# Altium project GPS_LEA5S.v.0.1.PrjPCB
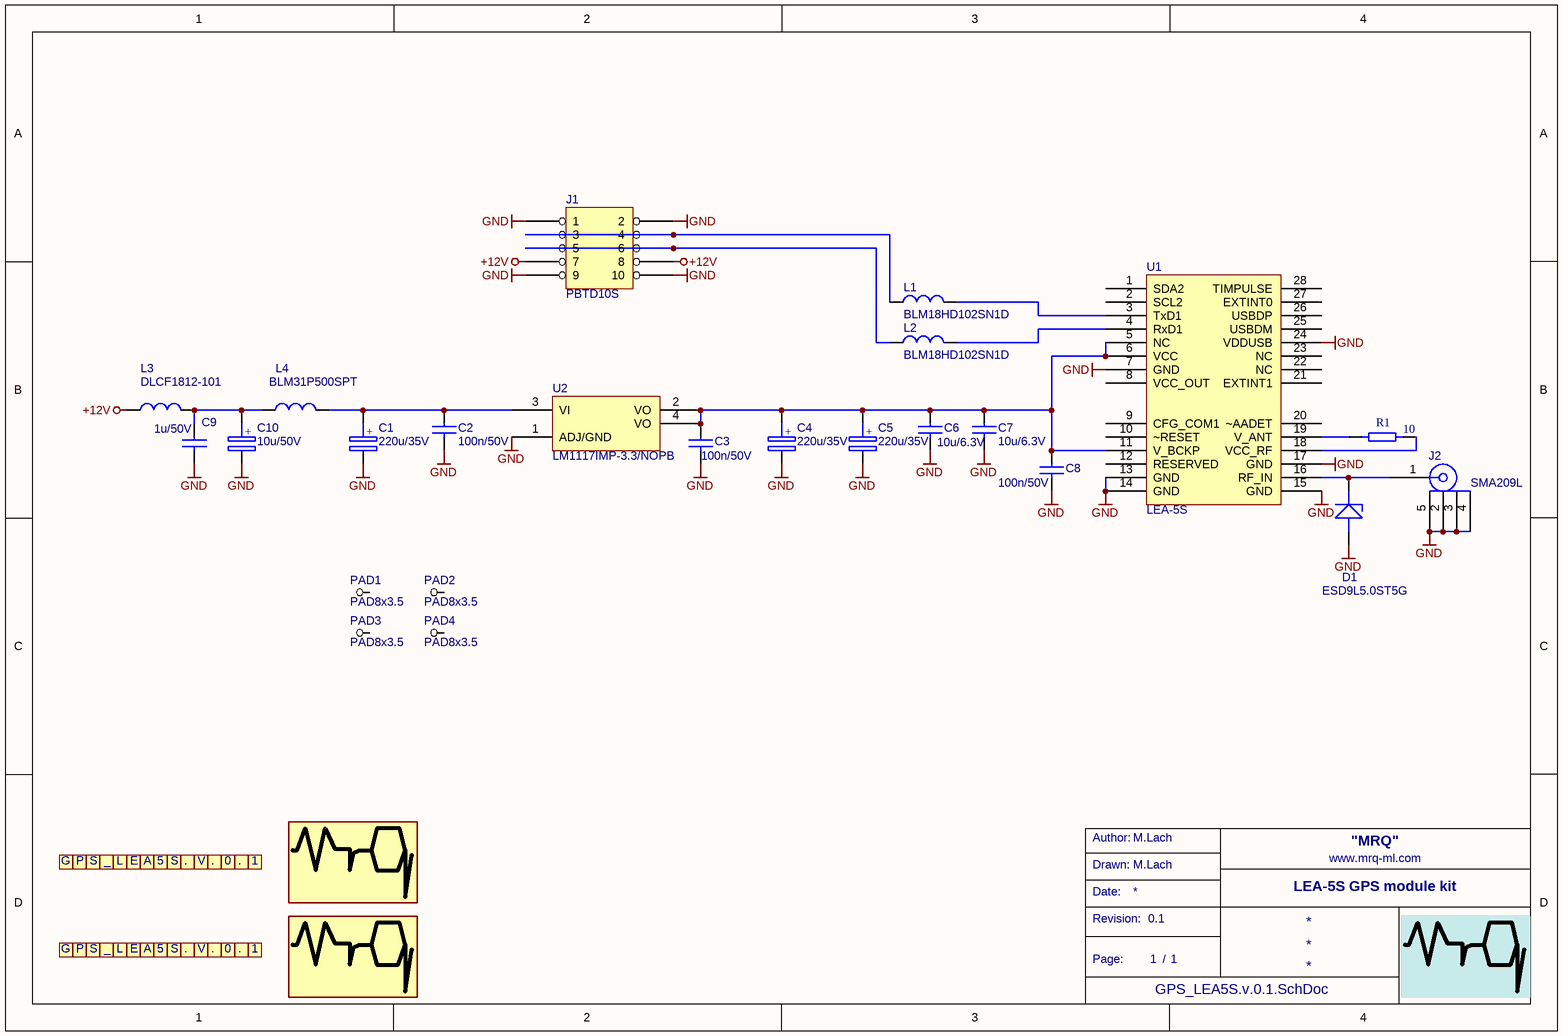
[diagram p0: GPS_LEA5S.v.0.1.SchDoc]
1 sheet, 57 parts. Net scope: global (net labels, ports and power ports of the same name join across sheets).
Board file: GPS_LEA5S.v.0.1.PcbDoc

## Sheet GPS_LEA5S.v.0.1.SchDoc: LEA-5S GPS module kit
size A4; Author: M.Lach; DrawnBy: M.Lach; Organization: "MRQ"; Address1: www.mrq-ml.com; DocumentNumber: 1; Revision: 0.1; SheetNumber: 1; SheetTotal: 1; LotOfPieces: 5

### Parts
C1  220u/35V  [CELE]
C2  100n/50V  [0805]
C3  100n/50V  [0805]
C4  220u/35V  [CELE]
C5  220u/35V  [CELE]
C6  10u/6.3V  [1206]
C7  10u/6.3V  [1206]
C8  100n/50V  [0805]
C9  1u/50V  [1206]
C10  10u/50V  [CE6.3x5.5]
D1  ESD9L5.0ST5G  [SOD923]
J1  PBTD10S  [PBTD10S]
J2  SMA209L  [SMA209L]
L1  BLM18HD102SN1D  [0603]
L2  BLM18HD102SN1D  [0603]
L3  DLCF1812-101  [1812]
L4  BLM31P500SPT  [1206]
LETTER1  LETTER_E  [LETTERC_E_60_10_TS]  (value not drawn)  (no BOM)
LETTER2  LETTER_DOT  [LETTER_DOT_60_10_TS]  (value not drawn)  (no BOM)
LETTER3  LETTER_G  [LETTERC_G_60_10_TS]  (value not drawn)  (no BOM)
LETTER4  LETTER_DOT  [LETTER_DOT_60_10_TS]  (value not drawn)  (no BOM)
LETTER5  LETTER_S  [LETTERC_S_60_10_TS]  (value not drawn)  (no BOM)
LETTER6  LETTER_P  [LETTERC_P_60_10_TS]  (value not drawn)  (no BOM)
LETTER7  LETTER_P  [LETTERC_L_60_10_TS]  (value not drawn)  (no BOM)
LETTER8  LETTER_DOT  [LETTER_DOT_60_10_TS]  (value not drawn)  (no BOM)
LETTER9  LETTER_1  [LETTER_1_60_10_TS]  (value not drawn)  (no BOM)
LETTER10  LETTER_G  [LETTERC_G_60_10_TS]  (value not drawn)  (no BOM)
LETTER11  LETTER_UNDERSCORE  [LETTER_UNDERSCORE_60_10_TS]  (value not drawn)  (no BOM)
LETTER12  LETTER_A_CAPITAL  [LETTERC_A_60_10_TS]  (value not drawn)  (no BOM)
LETTER13  LETTER_5  [LETTER_5_60_10_TS]  (value not drawn)  (no BOM)
LETTER14  LETTER_S  [LETTERC_S_60_10_TS]  (value not drawn)  (no BOM)
LETTER15  LETTER_P  [LETTERC_P_60_10_TS]  (value not drawn)  (no BOM)
LETTER16  LETTER_V  [LETTER_V_60_10_TS]  (value not drawn)  (no BOM)
LETTER17  LETTER_S  [LETTERC_S_60_10_TS]  (value not drawn)  (no BOM)
LETTER18  LETTER_0  [LETTER_0_60_10_TS]  (value not drawn)  (no BOM)
LETTER19  LETTER_UNDERSCORE  [LETTER_UNDERSCORE_60_10_TS]  (value not drawn)  (no BOM)
LETTER20  LETTER_P  [LETTERC_L_60_10_TS]  (value not drawn)  (no BOM)
LETTER21  LETTER_E  [LETTERC_E_60_10_TS]  (value not drawn)  (no BOM)
LETTER22  LETTER_A_CAPITAL  [LETTERC_A_60_10_TS]  (value not drawn)  (no BOM)
LETTER23  LETTER_5  [LETTER_5_60_10_TS]  (value not drawn)  (no BOM)
LETTER24  LETTER_S  [LETTERC_S_60_10_TS]  (value not drawn)  (no BOM)
LETTER25  LETTER_DOT  [LETTER_DOT_60_10_TS]  (value not drawn)  (no BOM)
LETTER26  LETTER_V  [LETTER_V_60_10_TS]  (value not drawn)  (no BOM)
LETTER27  LETTER_DOT  [LETTER_DOT_60_10_TS]  (value not drawn)  (no BOM)
LETTER28  LETTER_0  [LETTER_0_60_10_TS]  (value not drawn)  (no BOM)
LETTER29  LETTER_DOT  [LETTER_DOT_60_10_TS]  (value not drawn)  (no BOM)
LETTER30  LETTER_1  [LETTER_1_60_10_TS]  (value not drawn)  (no BOM)
LOGO1  MRQLOGO  [MRQ_5_TS]  (value not drawn)  (no BOM)
LOGO3  MRQLOGO  [MRQ_5_TS]  (value not drawn)  (no BOM)
PAD1  PAD8x3.5  [PAD8x3.5]  (no BOM)
PAD2  PAD8x3.5  [PAD8x3.5]  (no BOM)
PAD3  PAD8x3.5  [PAD8x3.5]  (no BOM)
PAD4  PAD8x3.5  [PAD8x3.5]  (no BOM)
R1  10  [0805]
TB  TITLEBLOCK  (value not drawn)  (graphical)
U1  LEA-5S  [LEA-LA]
U2  LM1117IMP-3.3/NOPB  [SOT-223]

### Nets
+12V: J1.7 J1.8 L3.1
GND: C1.1 C2.2 C3.2 C4.1 C5.1 C6.2 C7.2 C8.2 C9.2 C10.1 D1.ANOD J1.1 J1.2 J1.9 J1.10 J2.2 J2.3 J2.4 J2.5 U1.7(GND) U1.13(GND) U1.14(GND) U1.15(GND) U1.17(GND) U1.24(VDDUSB) U2.1(ADJ/GND)
NetC1_2: C1.2 C2.1 L4.2 U2.3(VI)
NetC3_1: C3.1 C4.2 C5.2 C6.1 C7.1 C8.1 U1.5(NC) U1.6(VCC) U1.11(V_BCKP) U2.2(VO) U2.4(VO)
NetC9_1: C9.1 C10.2 L3.2 L4.1
NetD1_CATH: D1.CATH J2.1 U1.16(RF_IN)
NetJ1_3: J1.3 J1.4 L1.1
NetJ1_5: J1.5 J1.6 L2.1
NetL1_2: L1.2 U1.3(TxD1)
NetL2_2: L2.2 U1.4(RxD1)
NetR1_1: R1.1 U1.19(V_ANT)
NetR1_2: R1.2 U1.18(VCC_RF)

Not connected (* = marked no-connect by the designer): PAD1 1; PAD2 1; PAD3 1; PAD4 1; U1 1(SDA2) 2(SCL2) 8(VCC_OUT) 9(CFG_COM1) 10(~RESET) 12(RESERVED) 20(~AADET) 21(EXTINT1) 22(NC) 23(NC) 25(USBDM) 26(USBDP) 27(EXTINT0) 28(TIMPULSE)

### Notes on the sheet
- (in symbol 10u/50V[[/\]]CE6.3x5.5[[/\]]50V[[/\]]20%[[/\]]CE10/50-SMD) +
- (in symbol 220u/35V[[/\]]CELE[[/\]]35V[[/\]]20%[[/\]]VRF227M1VFT2TRS1) +
- (in symbol LETTER_0) 0
- (in symbol LETTER_1) 1
- (in symbol LETTER_5) 5
- (in symbol LETTER_A) A
- (in symbol LETTER_DOT) .
- (in symbol LETTER_E) E
- (in symbol LETTER_G) G
- (in symbol LETTER_L) L
- (in symbol LETTER_P) P
- (in symbol LETTER_S) S
- (in symbol LETTER_UNDERSCORE) _
- (in symbol LETTER_V) V
- (in symbol TITLEBLOCK) Author:; Drawn:; Date:; Revision:; Page:; /

### Library data of the parts
C1 C4 C5 = 220u/35V[[/\]]CELE[[/\]]35V[[/\]]20%[[/\]]VRF227M1VFT2TRS1: Manufacturer1: Samxon; Reference1: VRF220/35; MaxVoltage: 35V; Tolerance: 20%; Tmin: -55; Tmax: +105; Descript: capacitor 220uF, 6.3V, CELE (8x10.2); DeliveryTime1: up to 14 days; Currency1: PLZ; Amount1: 1000+; Amount5: 10+; Amount3: 250+; Amount4: 50+; Value: 220u/35V; Price1: 0,65; Supplier1: tme.pl; Typ1: VRF227M1VFT2TRS1; Dimensions: CELE; OtherParams: VRF227M1VFT2TRS1; ComponentLink1Description: Datasheet; ComponentLink1URL: http://www.mrq-ml.com/Parts/Capacitors/vrf.pdf; Supplier5: tme.pl; Reference5: VRF220/35; Manufacturer5: Samxon; Typ5: VRF227M1VFT2TRS1; DeliveryTime5: up to 14 days; Price5: 0,99; Currency5: PLZ; Currency3: PLZ; Currency4: PLZ; DateOfPrice1: 2009-10-06; DateOfPrice3: 2009-10-06; DateOfPrice4: 2009-10-06; DateOfPrice5: 2009-10-06; DeliveryTime3: up to 14 days; DeliveryTime4: up to 14 days; Manufacturer3: Samxon; Manufacturer4: Samxon; Price3: 0,73; Price4: 0,49; Reference3: VRF220/35; Reference4: VRF220/35; Supplier3: tme.pl; Supplier4: tme.pl; Typ3: VRF227M1VFT2TRS1; Typ4: VRF227M1VFT2TRS1
C2 C3 C8 = 100n/50V[[/\]]0805[[/\]]50V[[/\]]10%[[/\]]CL21B104KBCNNNC: Manufacturer1: Samsung; MaxVoltage: 50V; Tolerance: 10%; Tmin: -55; Tmax: +125; Descript: capacitor 100nF/50V, 0805, X7R, 10%; Currency1: PLZ; Amount1: 12000+; Amount5: 100+; Amount2: 4000+; Amount3: 1000+; Amount4: 300+; DeliveryTime1: up to 14 days; Supplier1: tme.pl; Price1: 0,011; Value: 100n/50V; Supplier2: tme.pl; Supplier3: tme.pl; Price2: 0,013; Price3: 0,017; Reference1: CL21B104KBCNNNC; Reference2: CL21B104KBCNNNC; Reference3: CL21B104KBCNNNC; Typ1: CL21B104KBCNNNC; Dimensions: 0805; OtherParams: CL21B104KBCNNNC; Supplier5: tme.pl; Reference5: CL21B104KBCNNNC; Manufacturer5: Samsung; Typ5: CL21B104KBCNNNC; Price5: 0,031; Currency5: PLZ; ComponentLink1Description: Datasheet; ComponentLink1URL: http://www.mrq-ml.com/Parts/Capacitors/mlcc_samsung.pdf; Currency2: PLZ; Currency3: PLZ; Currency4: PLZ; DateOfPrice1: 2009-07-22; DateOfPrice2: 2009-07-22; DateOfPrice3: 2009-07-22; DateOfPrice4: 2009-07-22; DateOfPrice5: 2009-07-22; DeliveryTime2: up to 14 days; DeliveryTime3: up to 14 days; DeliveryTime4: up to 14 days; DeliveryTime5: up to 14 days; Manufacturer2: Samsung; Manufacturer3: Samsung; Manufacturer4: Samsung; Price4: 0,024; Reference4: CL21B104KBCNNNC; Supplier4: tme.pl; Typ2: CL21B104KBCNNNC; Typ3: CL21B104KBCNNNC; Typ4: CL21B104KBCNNNC
C6 C7 = 10u/6.3V[[/\]]1206[[/\]]6.3V[[/\]]10%[[/\]]CL31B106KQHNNNE: Manufacturer1: Samsung; Amount2: 4000+; Amount3: 1000+; MaxVoltage: 6.3V; Tolerance: 10%; Tmin: -55; Tmax: +125; Descript: capacitor, 1206, 10uF, 6.3V, 10%, X7R; DeliveryTime1: up to 14 days; Currency1: PLZ; Amount1: 12000+; Amount5: 100+; Amount4: 300+; Supplier1: tme.pl; Price1: 0,21; Value: 10u/6.3V; Supplier2: tme.pl; Supplier3: tme.pl; Price2: 0,24; Price3: 0,27; Reference1: CL31B106KQHNNNE; Reference2: CL31B106KQHNNNE; Reference3: CL31B106KQHNNNE; Typ1: CL31B106KQHNNNE; Manufacturer2: Samsung; Manufacturer3: Samsung; Dimensions: 1206; OtherParams: CL31B106KQHNNNE; Typ2: CL31B106KQHNNNE; DeliveryTime2: up to 14 days; Currency2: PLZ; Typ3: CL31B106KQHNNNE; DeliveryTime3: up to 14 days; Currency3: PLZ; Supplier5: tme.pl; Reference5: CL31B106KQHNNNE; Manufacturer5: Samsung; Typ5: CL31B106KQHNNNE; DeliveryTime5: up to 14 days; Price5: 0,39; Currency5: PLZ; Currency4: PLZ; DateOfPrice1: 2009-10-06; DateOfPrice2: 2009-10-06; DateOfPrice3: 2009-10-06; DateOfPrice4: 2009-10-06; DateOfPrice5: 2009-10-06; DeliveryTime4: up to 14 days; Manufacturer4: Samsung; Price4: 0,31; Reference4: CL31B106KQHNNNE; Supplier4: tme.pl; Typ4: CL31B106KQHNNNE
C9 = 1u/50V[[/\]]1206[[/\]]50V[[/\]]10%[[/\]]C1206C105K5RAC: Manufacturer1: KEMET; MaxVoltage: 50V; Tolerance: 10%; Tmin: -55; Tmax: +125; Descript: capacitor 1uF/50V 10%; Currency1: PLZ; Amount1: 10000+; Amount5: 100+; Amount2: 2500+; Amount3: 1000+; Amount4: 300+; DeliveryTime1: up to 14 days; Supplier1: tme.pl; Price1: 0,065; Value: 1u/50V; Reference1: C1206C105K5RAC; Typ1: C1206C105K5RAC; Dimensions: 1206; OtherParams: C1206C105K5RAC; ComponentLink1Description: Datasheet; ComponentLink1URL: http://www.mrq-ml.com/Parts/Capacitors/ceramic_chip_kemet.pdf; Supplier5: tme.pl; Reference5: C1206C105K5RAC; Manufacturer5: KEMET; Typ5: C1206C105K5RAC; Price5: 0,11; Currency5: PLZ; Currency2: PLZ; Currency3: PLZ; Currency4: PLZ; DateOfPrice1: 2009-10-03; DateOfPrice2: 2009-10-03; DateOfPrice3: 2009-10-03; DateOfPrice4: 2009-10-03; DateOfPrice5: 2009-10-03; DeliveryTime2: up to 14 days; DeliveryTime3: up to 14 days; DeliveryTime4: up to 14 days; DeliveryTime5: up to 14 days; Manufacturer2: KEMET; Manufacturer3: KEMET; Manufacturer4: KEMET; Price2: 0,072; Price3: 0,079; Price4: 0,095; Reference2: C1206C105K5RAC; Reference3: C1206C105K5RAC; Reference4: C1206C105K5RAC; Supplier2: tme.pl; Supplier3: tme.pl; Supplier4: tme.pl; Typ2: C1206C105K5RAC; Typ3: C1206C105K5RAC; Typ4: C1206C105K5RAC
C10 = 10u/50V[[/\]]CE6.3x5.5[[/\]]50V[[/\]]20%[[/\]]CE10/50-SMD: MaxVoltage: 50V; Tolerance: 20%; Descript: capacitor electrolythic 10uF/50V, 20%, 6.3x5.5mm; Currency1: PLZ; Amount1: 1000+; Amount5: 10+; Amount3: 250+; Amount4: 50+; DeliveryTime1: up to 14 days; Value: 10u/50V; Price1: 0,14; Reference1: CE10/50-SMD; Supplier1: tme.pl; Dimensions: CE6.3x5.5; OtherParams: CE10/50-SMD; Supplier5: tme.pl; Reference5: CE10/50-SMD; Price5: 0,29; Currency5: PLZ; Currency3: PLZ; Currency4: PLZ; DateOfPrice1: 2009-10-06; DateOfPrice3: 2009-10-06; DateOfPrice4: 2009-10-06; DateOfPrice5: 2009-10-06; DeliveryTime3: up to 14 days; DeliveryTime4: up to 14 days; DeliveryTime5: up to 14 days; Price3: 0,18; Price4: 0,24; Reference3: CE10/50-SMD; Reference4: CE10/50-SMD; Supplier3: tme.pl; Supplier4: tme.pl
D1 = ESD9L5.0ST5G[[/\]]SOD923: Manufacturer1: ON Semiconductor; Tmin: -55; Tmax: +125; Descript: ESD protection diode with ultra-low capacitance; Reference1: 1651639; DeliveryTime1: up to 14 days; Currency1: EUR; Amount1: 500+; Amount5: 1+; Amount2: 100+; Amount3: 50+; Amount4: 25+; Value: ESD9L5.0ST5G; Dimensions: SOD923; ComponentLink1Description: Datasheet; ComponentLink1URL: http://www.mrq-ml.com/Parts/Diodes/ESD9L5.0S-D.pdf; Supplier1: farnell.com; Typ1: ESD9L5.0ST5G; Price1: 0,36; Supplier5: farnell.com; Reference5: 1651639; Manufacturer5: ON Semiconductor; Typ5: ESD9L5.0ST5G; DeliveryTime5: up to 14 days; Price5: 0,63; Currency5: EUR; Currency2: EUR; Currency3: EUR; Currency4: EUR; DateOfPrice1: 2009-10-06; DateOfPrice2: 2009-10-06; DateOfPrice3: 2009-10-06; DateOfPrice4: 2009-10-06; DateOfPrice5: 2009-10-06; DeliveryTime2: up to 14 days; DeliveryTime3: up to 14 days; DeliveryTime4: up to 14 days; Manufacturer2: ON Semiconductor; Manufacturer3: ON Semiconductor; Manufacturer4: ON Semiconductor; Price2: 0,44; Price3: 0,51; Price4: 0,6; Reference2: 1651639; Reference3: 1651639; Reference4: 1651639; Supplier2: farnell.com; Supplier3: farnell.com; Supplier4: farnell.com; Typ2: ESD9L5.0ST5G; Typ3: ESD9L5.0ST5G; Typ4: ESD9L5.0ST5G
J1 = PBTD10S[[/\]]PBTD10S: Connector; Manufacturer1: Greenconn; Tmin: -40; Tmax: +105; Descript: SMD connector 2.54mm 2x5pin, female; Typ1: G SHC221-10 10 A 01; DeliveryTime1: up to 14 days; Currency1: PLZ; Amount1: 500+; Amount5: 1+; Amount3: 250+; Amount4: 48+; Value: PBTD10S; Dimensions: PBTD10S; ComponentLink1Description: Datasheet; ComponentLink1URL: http://www.mrq-ml.com/Parts/Connectors/pb_td.pdf; Supplier1: maritex.com.pl; Reference1: PBTD10S; Price1: 0,67; Supplier5: maritex.com.pl; Reference5: PBTD10S; Manufacturer5: Greenconn; Typ5: G SHC221-10 10 A 01; DeliveryTime5: up to 14 days; Price5: 0,86; Currency5: PLZ; Currency3: PLZ; Currency4: PLZ; DateOfPrice1: 2009-10-06; DateOfPrice3: 2009-10-06; DateOfPrice4: 2009-10-06; DateOfPrice5: 2009-10-06; DeliveryTime3: up to 14 days; DeliveryTime4: up to 14 days; Manufacturer3: Greenconn; Manufacturer4: Greenconn; Price3: 0,69; Price4: 0,73; Reference3: PBTD10S; Reference4: PBTD10S; Supplier3: maritex.com.pl; Supplier4: maritex.com.pl; Typ3: G SHC221-10 10 A 01; Typ4: G SHC221-10 10 A 01
J2 = SMA209L[[/\]]SMA209L: Descript: SMA connector for PCB angled, female; DeliveryTime1: up to 14 days; Currency1: PLZ; Amount1: 500+; Amount5: 1+; Amount2: 100+; Amount3: 50+; Amount4: 10+; Value: SMA209L; Dimensions: SMA209L; ComponentLink1Description: Datasheet; ComponentLink1URL: http://www.mrq-ml.com/Parts/Connectors/SMA209L.pdf; Supplier1: maritex.com.pl; Reference1: SMA209L; Price1: 3,89; Supplier5: maritex.com.pl; Reference5: SMA209L; DeliveryTime5: up to 14 days; Price5: 4,99; Currency5: PLZ; Currency2: PLZ; Currency3: PLZ; Currency4: PLZ; DateOfPrice1: 2009-10-06; DateOfPrice2: 2009-10-06; DateOfPrice3: 2009-10-06; DateOfPrice4: 2009-10-06; DateOfPrice5: 2009-10-06; DeliveryTime2: up to 14 days; DeliveryTime3: up to 14 days; DeliveryTime4: up to 14 days; Price2: 4,24; Price3: 4,39; Price4: 4,64; Reference2: SMA209L; Reference3: SMA209L; Reference4: SMA209L; Supplier2: maritex.com.pl; Supplier3: maritex.com.pl; Supplier4: maritex.com.pl
L1 L2 = BLM18HD102SN1D[[/\]]0603: Manufacturer1: Murata; Tmin: -55; Tmax: +125; Descript: Chip EMIFIL Inductor Type for GHz Noise Chip Ferrite Beads; DeliveryTime1: 4 weeks; Currency1: USD; Amount1: 4000+; Reference5: 1515727; DeliveryTime5: up to 14 days; Currency5: EUR; Amount5: 5+; Amount2: 500+; Amount3: 100+; Amount4: 50+; Value: BLM18HD102SN1D; Dimensions: 0603; ComponentLink1Description: Datasheet; ComponentLink1URL: http://www.mrq-ml.com/Parts/Inductors/BLM18H.pdf; Supplier1: microdis.net; Reference1: BLM18HD102SN1D; Typ1: BLM18HD102SN1D; Price1: 0,056; Supplier5: farnell.com; Manufacturer5: Murata; Typ5: BLM18HD102SN1D; Price5: 0,145; Supplier2: farnell.com; Reference2: 1515727; Manufacturer2: Murata; Typ2: BLM18HD102SN1D; DeliveryTime2: up to 14 days; Price2: 0,068; Currency2: EUR; Supplier3: farnell.com; Reference3: 1515727; Manufacturer3: Murata; Typ3: BLM18HD102SN1D; DeliveryTime3: up to 14 days; Price3: 0,094; Currency3: EUR; Currency4: EUR; DateOfPrice1: 2009-10-04; DateOfPrice2: 2009-10-04; DateOfPrice3: 2009-10-04; DateOfPrice4: 2009-10-04; DateOfPrice5: 2009-10-04; DeliveryTime4: up to 14 days; Manufacturer4: Murata; Price4: 0,106; Reference4: 1515727; Supplier4: farnell.com; Typ4: BLM18HD102SN1D
L3 = DLCF1812-101[[/\]]1812: Manufacturer1: Frontier Electronics; Tmin: -25; Tmax: +100; Descript: Ferrite choke 100uH, 110mA; Typ1: CF453232-101X-LFR; DeliveryTime1: up to 14 days; Currency1: PLZ; Amount1: 100+; Amount5: 1+; Amount3: 50+; Amount4: 10+; Value: DLCF1812-101; Dimensions: 1812; ComponentLink1Description: Datasheet; ComponentLink1URL: http://www.mrq-ml.com/Parts/Inductors/lcf453232.pdf; Supplier1: maritex.com.pl; Reference1: DLCF1812-101; Price1: 2,35; Supplier5: maritex.com.pl; Reference5: DLCF1812-101; Manufacturer5: Frontier Electronics; Typ5: CF453232-101X-LFR; DeliveryTime5: up to 14 days; Price5: 3,2; Currency5: PLZ; Currency3: PLZ; Currency4: PLZ; DateOfPrice1: 2009-10-06; DateOfPrice3: 2009-10-06; DateOfPrice4: 2009-10-06; DateOfPrice5: 2009-10-06; DeliveryTime3: up to 14 days; DeliveryTime4: up to 14 days; Manufacturer3: Frontier Electronics; Manufacturer4: Frontier Electronics; Price3: 2,49; Price4: 2,88; Reference3: DLCF1812-101; Reference4: DLCF1812-101; Supplier3: maritex.com.pl; Supplier4: maritex.com.pl; Typ3: CF453232-101X-LFR; Typ4: CF453232-101X-LFR
L4 = BLM31P500SPT[[/\]]1206: Manufacturer1: Murata; Tmin: -55; Tmax: +125; Descript: Ferrite bead SMD, 1206, 3A, 0,025ohm; Typ1: BLM31PG500SN1L; Currency1: PLZ; Amount1: 2000+; DeliveryTime5: up to 14 days; Amount5: 100+; Amount2: 1000+; Amount3: 500+; Value: BLM31P500SPT; Dimensions: 1206; ComponentLink1Description: Datasheet; ComponentLink1URL: http://www.mrq-ml.com/Parts/Inductors/Murata_EMI_Suppression_Filters_DC.pdf; Supplier1: tme.pl; Reference1: BLM31P500SPT; Price1: 0,35; Supplier5: tme.pl; Reference5: BLM31P500SPT; Manufacturer5: Murata; Typ5: BLM31PG500SN1L; Price5: 0,45; Currency5: PLZ; Currency2: PLZ; Currency3: PLZ; DateOfPrice1: 2009-08-16; DateOfPrice2: 2009-08-16; DateOfPrice3: 2009-08-16; DateOfPrice5: 2009-08-16; Manufacturer2: Murata; Manufacturer3: Murata; Price2: 0,35; Price3: 0,41; Reference2: BLM31P500SPT; Reference3: BLM31P500SPT; Supplier2: tme.pl; Supplier3: tme.pl; Typ2: BLM31PG500SN1L; Typ3: BLM31PG500SN1L
LETTER7 LETTER20 = LETTER_L: Value: LETTER_P
LETTER12 LETTER22 = LETTER_A: Value: LETTER_A_CAPITAL
R1 = 10[[/\]]0805[[/\]]0.125W[[/\]]5%[[/\]]RC0805JR-0710RL: Manufacturer1: Yageo; Amount1: 50000+; DissPower: 0.125W; Tolerance: 5%; Tmin: -55; Tmax: +155; Descript: Resistor 10ohm, 0805, 5%; DeliveryTime1: up to 3 days; Currency1: PLZ; Amount2: 15000+; Amount3: 5000+; Amount4: 1000+; Amount5: 100+; Value: 10; Price1: 0,003; Reference1: RC0805JR-0710R; Supplier1: tme.pl; Typ1: RC0805JR-0710RL; Dimensions: 0805; OtherParams: RC0805JR-0710RL; Price2: 0,004; Price3: 0,008; Reference2: RC0805JR-0710R; Reference3: RC0805JR-0710R; Supplier2: tme.pl; Supplier3: tme.pl; Manufacturer2: Yageo; Typ2: RC0805JR-0710RL; Manufacturer3: Yageo; Typ3: RC0805JR-0710RL; DateOfPrice1: 2009-07-22; DeliveryTime2: up to 3 days; Currency2: PLZ; DateOfPrice2: 2009-07-22; DeliveryTime3: up to 3 days; Currency3: PLZ; DateOfPrice3: 2009-07-22; Supplier4: tme.pl; Reference4: RC0805JR-0710R; Manufacturer4: Yageo; Typ4: RC0805JR-0710RL; DeliveryTime4: up to 3 days; Price4: 0,013; Currency4: PLZ; DateOfPrice4: 2009-07-22; Supplier5: tme.pl; Reference5: RC0805JR-0710R; Manufacturer5: Yageo; Typ5: RC0805JR-0710RL; DeliveryTime5: up to 3 days; Price5: 0,022; Currency5: PLZ; DateOfPrice5: 2009-07-22; ComponentLink1Description: Datasheet; ComponentLink1URL: http://www.mrq-ml.com/Parts/Resistors/rc0805yageo.pdf
U1 = LEA-5S[[/\]]LEA-LA: Manufacturer1: ublox; Tmin: -40; Tmax: +85; Descript: GPS Module; DeliveryTime1: up to 14 days; Currency1: EUR; Amount1: 250+; Amount5: 10+; Value: LEA-5S; Dimensions: LEA-LA; ComponentLink1Description: Datasheet; ComponentLink1URL: http://www.mrq-ml.com/Parts/Other/LEA-5x_Data_Sheet(GPS.G5-MS5-07026).pdf; Supplier1: microdis.net; Reference1: LEA-5S; Typ1: LEA-5S; Price1: 15,1; Supplier5: microdis.net; Reference5: LEA-5S; Manufacturer5: ublox; Typ5: LEA-5S; DeliveryTime5: up to 14 days; Price5: 17; Currency5: EUR; DateOfPrice1: 2009-10-06; DateOfPrice5: 2009-10-06
U2 = LM1117IMP-3.3/NOPB[[/\]]SOT-223: Manufacturer1: National Semiconductor; Reference1: 1469051; Amount1: 500+; Tmin: -40; Tmax: +125; Descript: 800mA low-dropout linera regulator 3.3V; DeliveryTime1: up to 3 days; Currency1: EUR; Amount5: 1+; Amount2: 250+; Amount3: 100+; Amount4: 20+; Value: LM1117IMP-3.3/NOPB; Price1: 0,35; Supplier1: farnell.com; Dimensions: SOT-223; ComponentLink1Description: Datasheet; ComponentLink1URL: http://www.mrq-ml.com/Parts/ICs/LM1117.pdf; Typ1: LM1117IMP-3.3/NOPB; Supplier5: farnell.com; Reference5: 1469051; Manufacturer5: National Semiconductor; Typ5: LM1117IMP-3.3/NOPB; DeliveryTime5: up to 3 days; Price5: 0,81; Currency5: EUR; Currency2: EUR; Currency3: EUR; Currency4: EUR; DateOfPrice1: 2009-08-04; DateOfPrice2: 2009-08-04; DateOfPrice3: 2009-08-04; DateOfPrice4: 2009-08-04; DateOfPrice5: 2009-08-04; DeliveryTime2: up to 3 days; DeliveryTime3: up to 3 days; DeliveryTime4: up to 3 days; Manufacturer2: National Semiconductor; Manufacturer3: National Semiconductor; Manufacturer4: National Semiconductor; Price2: 0,4; Price3: 0,46; Price4: 0,46; Reference2: 1469051; Reference3: 1469051; Reference4: 1469051; Supplier2: farnell.com; Supplier3: farnell.com; Supplier4: farnell.com; Typ2: LM1117IMP-3.3/NOPB; Typ3: LM1117IMP-3.3/NOPB; Typ4: LM1117IMP-3.3/NOPB
LETTER1 LETTER21 = LETTER_E: Value: LETTER_E
LETTER2 LETTER4 LETTER8 LETTER25 LETTER27 LETTER29 = LETTER_DOT: Value: LETTER_DOT
LETTER3 LETTER10 = LETTER_G: Value: LETTER_G
LETTER5 LETTER14 LETTER17 LETTER24 = LETTER_S: Value: LETTER_S
LETTER6 LETTER15 = LETTER_P: Value: LETTER_P
LETTER9 LETTER30 = LETTER_1: Value: LETTER_1
LETTER11 LETTER19 = LETTER_UNDERSCORE: Value: LETTER_UNDERSCORE
LETTER13 LETTER23 = LETTER_5: Value: LETTER_5
LETTER16 LETTER26 = LETTER_V: Value: LETTER_V
LETTER18 LETTER28 = LETTER_0: Value: LETTER_0
LOGO1 LOGO3 = MRQLOGO: Value: MRQLOGO